# Altium schematic sheet POWER.SchDoc
size A4
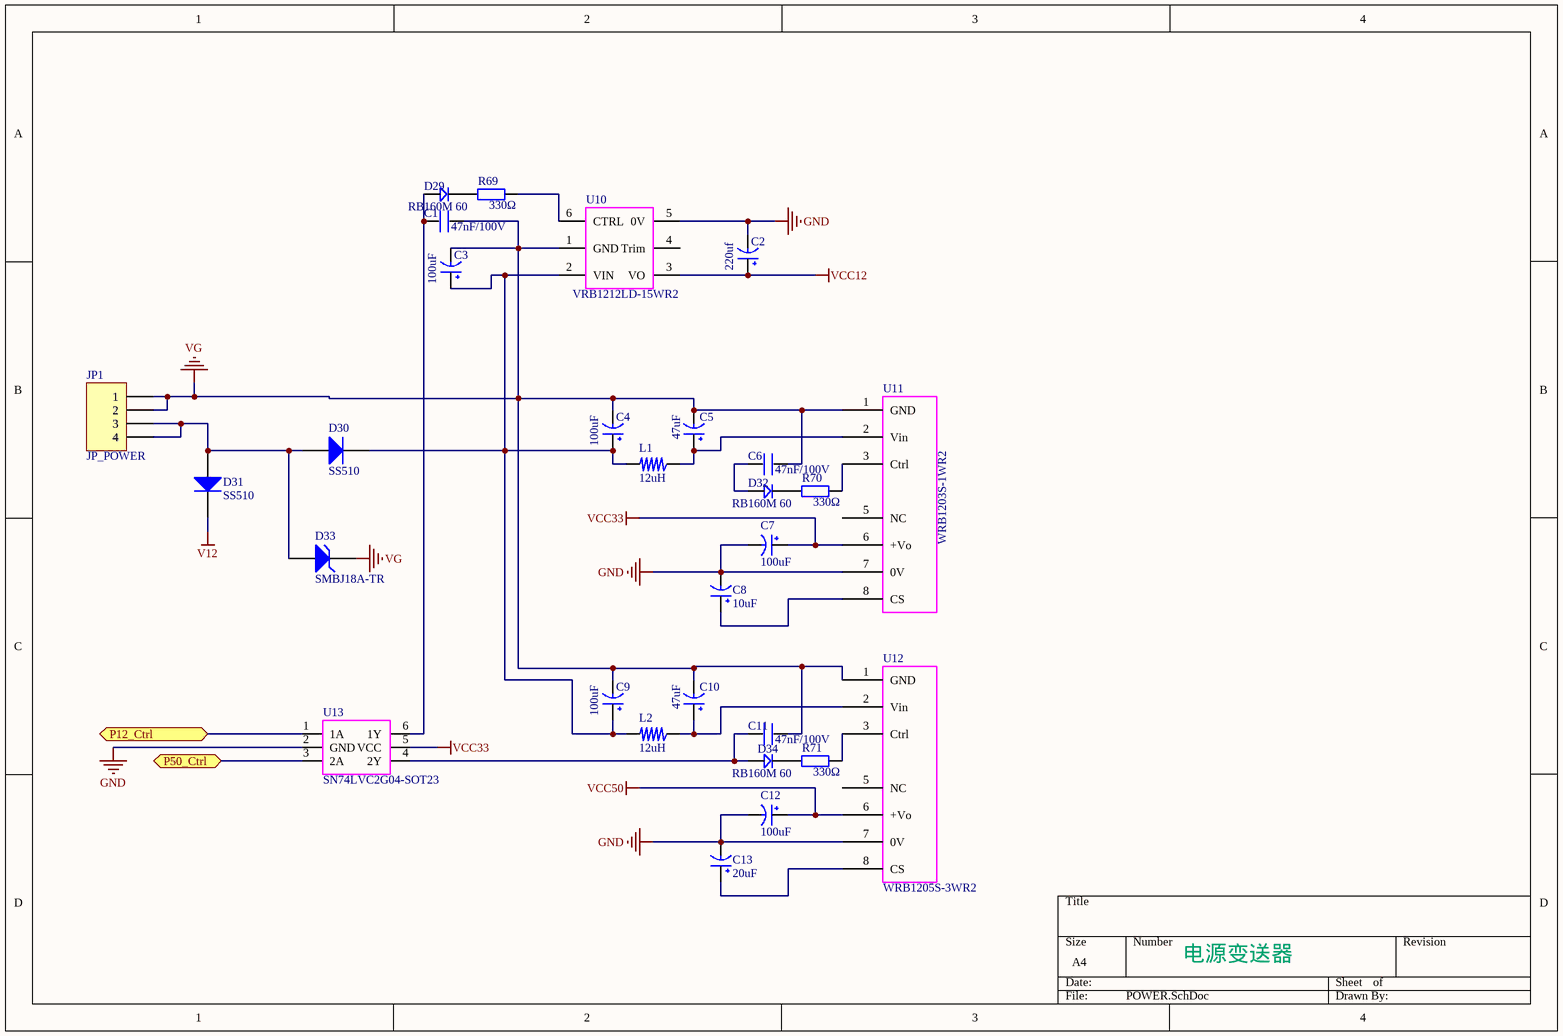
[diagram p0: POWER.SchDoc]

## Parts
C1  47nF/100V  [0603P]
C2  220uf  [SMD-EC-F6.3]
C3  100uF  [SMD-EC-F6.3]
C4  100uF  [SMD-EC-F6.3]
C5  47uF  [SMD-EC-F6.3]
C6  47nF/100V  [0603P]
C7  100uF  [SMD-EC-F6.3]
C8  10uF  [SMD-EC-F4]
C9  100uF  [SMD-EC-F6.3]
C10  47uF  [SMD-EC-F6.3]
C11  47nF/100V  [0603P]
C12  100uF  [SMD-EC-F6.3]
C13  20uF  [SMD-EC-F4]
D29  RB160M 60  [SOD123/X.85]
D30  SS510  [SMC]
D31  SS510  [SMC]
D32  RB160M 60  [SOD123/X.85]
D33  SMBJ18A-TR  [DO-214]
D34  RB160M 60  [SOD123/X.85]
JP1  JP_POWER  [3.81-4P]
L1  12uH  [4R7_L_7_7_4]
L2  12uH  [4R7_L_7_7_4]
R69  value 330Ω  [1206]  (hidden comment: Res2)
R70  value 330Ω  [1206]  (hidden comment: Res2)
R71  value 330Ω  [1206]  (hidden comment: Res2)
U10  VRB1212LD-15WR2  [VRB1212LD-15WR2]
U11  WRB1203S-1WR2  [WRB120XS-XWR2]
U12  WRB1205S-3WR2  [WRB120XS-XWR2]
U13  SN74LVC2G04-SOT23  [SOT23-6]

## Ports
P12_Ctrl, P50_Ctrl

## Nets
GND: C2.2(GND) C7.2(GND) C8.2(GND) C12.2(GND) C13.2(GND) U10.5(0V) U11.7(0V) U12.7(0V) U13.2(GND)
V12: D31.2(K)
VCC12: C2.1(VCC) U10.3(VO)
VCC33: C7.1(VCC) U11.6(+Vo) U13.5(VCC)
VCC50: C12.1(VCC) U12.6(+Vo)
VG: C1.2 C3.2(GND) C4.2(GND) C5.2(GND) C6.2 C9.2(GND) C10.2(GND) C11.2 D33.2(K) JP1.1 JP1.2 U10.1(GND) U11.1(GND) U12.1(GND)
P12_Ctrl: U13.1(1A) ; port P12_Ctrl
P50_Ctrl: U13.3(2A) ; port P50_Ctrl
NetC1_1: C1.1 D29.1 U13.6(1Y)
NetC3_1: C3.1(VCC) C4.1(VCC) C9.1(VCC) D30.2(K) L1.2 L2.2 U10.2(VIN)
NetC5_1: C5.1(VCC) L1.1 U11.2(Vin)
NetC6_1: C6.1 D32.1
NetC8_1: C8.1(VCC) U11.8(CS)
NetC10_1: C10.1(VCC) L2.1 U12.2(Vin)
NetC11_1: C11.1 D34.1 U13.4(2Y)
NetC13_1: C13.1(VCC) U12.8(CS)
NetD29_2: D29.2 R69.2
NetD30_1: D30.1(A) D31.1(A) D33.1(A) JP1.3 JP1.4
NetD32_2: D32.2 R70.2
NetD34_2: D34.2 R71.2
NetR69_1: R69.1 U10.6(CTRL)
NetR70_1: R70.1 U11.3(Ctrl)
NetR71_1: R71.1 U12.3(Ctrl)

Not connected (* = marked no-connect by the designer): U10 4(Trim); U11 5(NC); U12 5(NC)

## Notes on the sheet
- 电源变送器

## Library data of the parts
C1 C6 C11 = C
C2-C5 C7-C10 C12 C13 = CAP
D29 D32 D34 = D
D30 D31 = Diode: Default Diode; Published: 8-Jun-2000; LatestRevisionDate: 17-Jul-2002; LatestRevisionNote: Re-released for DXP Platform.; PackageVersion: Sep-1996; PackageReference: SMC; Publisher: Altium Limited; Code_JEDEC: DO-214-AB
D33 = D Zener: Zener Diode; Published: 8-Jun-2000; LatestRevisionDate: 17-Jul-2002; LatestRevisionNote: Re-released for DXP Platform.; PackageReference: DIODE-0.7; Publisher: Altium Limited
JP1 = Header 4: Header, 4-Pin; LatestRevisionDate: 17-Jul-2002; LatestRevisionNote: Re-released for DXP Platform.; Publisher: Altium Limited
L1 L2 = L_SOP
R69-R71 = Res2: Resistor; Published: 8-Jun-2000; LatestRevisionDate: 17-Jul-2002; LatestRevisionNote: Re-released for DXP Platform.; PackageReference: AXIAL-0.4; Publisher: Altium Limited